# EAGLE design untitled (EAGLE 5.08)
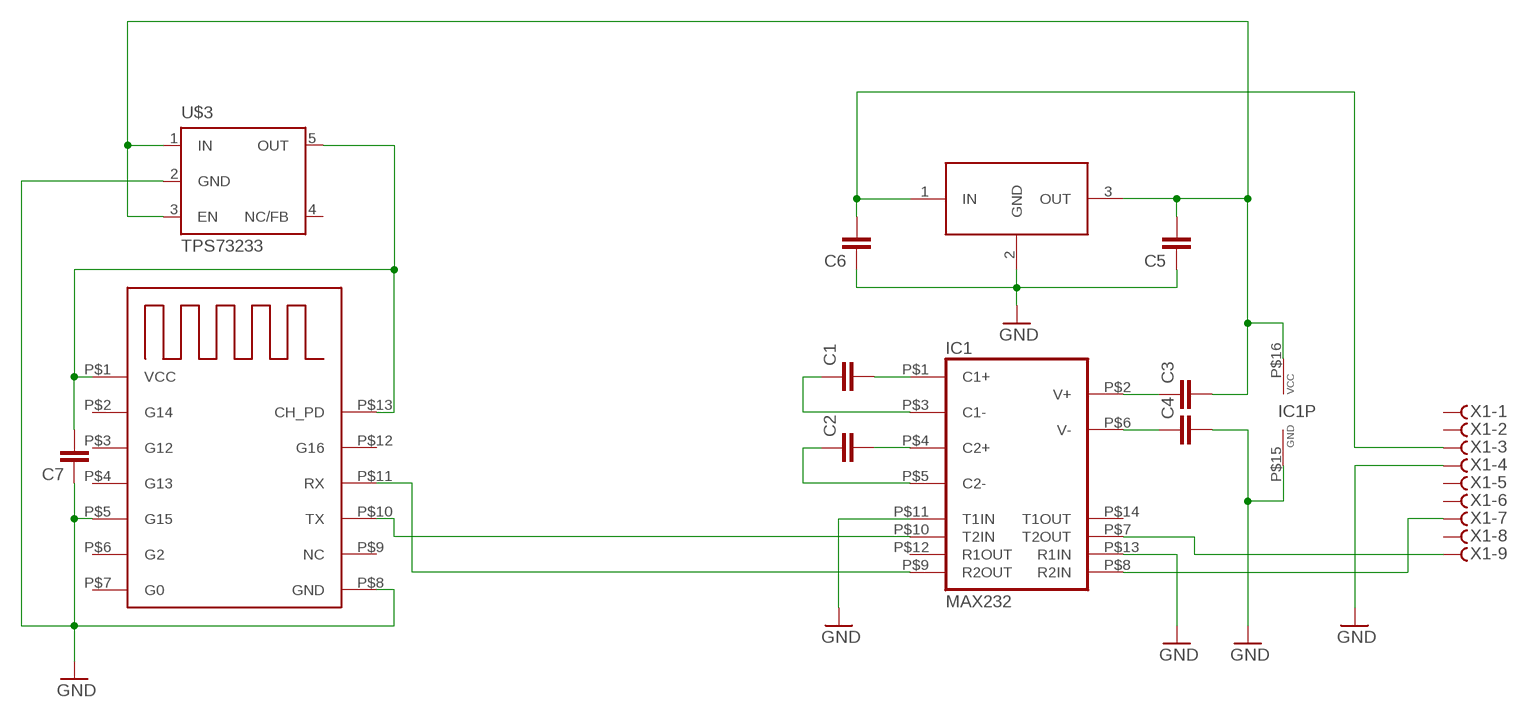
[diagram p0: schematic, sheet 1]

## Parts
C1  C-EUC1206K  [C1206K]
C2  C-EUC1206K  [C1206K]
C3  C-EUC1206K  [C1206K]
C4  C-EUC1206K  [C1206K]
C5  C-EUC1206K  [C1206K]
C6  C-EUC1206K  [C1206K]
C7  C-EUC1206K  [C1206K]
IC1  MAX232  [DIL16]
U$1  ESP03  [ESP03]
U$2  LM78M05BG  [DPACK]
U$3  TPS73233  [SOT23-DBV]
X1  F09HS  [F09H]

## Nets
GND: C4.2 C5.1 C6.1 C7.1 IC1.P$11(T1IN) IC1.P$13(R1IN) IC1.P$15(GND) U$1.P$5(G15) U$1.P$8(GND) U$2.2(GND) U$3.2(GND) X1.4
N$1: C2.2 IC1.P$4(C2+)
N$2: C2.1 IC1.P$5(C2-)
N$3: C1.2 IC1.P$1(C1+)
N$4: C1.1 IC1.P$3(C1-)
N$5: C3.1 IC1.P$2(V+)
N$6: C4.1 IC1.P$6(V-)
N$7: IC1.P$10(T2IN) U$1.P$10(TX)
N$8: IC1.P$9(R2OUT) U$1.P$11(RX)
N$9: IC1.P$7(T2OUT) X1.9
N$10: IC1.P$8(R2IN) X1.7
N$11: C6.2 U$2.1(IN) X1.3
N$13: C7.2 U$1.P$1(VCC) U$1.P$13(CH_PD) U$3.5(OUT)
N$15: C3.2 C5.2 IC1.P$16(VCC) U$2.3(OUT) U$3.1(IN) U$3.3(EN)
Unconnected: IC1.P$12(R1OUT) IC1.P$14(T1OUT) U$1.P$2(G14) U$1.P$3(G12) U$1.P$4(G13) U$1.P$6(G2) U$1.P$7(G0) U$1.P$9(NC) U$1.P$12(G16) U$3.4(NC/FB) X1.1 X1.2 X1.5 X1.6 X1.8

## Library data of the parts
C1-C7 = rcl:C-EU: CAPACITOR, European symbol
IC1 = connectors:MAX232: RS232 TRANSEIVER
U$1 = connectors:ESP03
U$2 = stabil:LM78M05BG
U$3 = stabil:TPS73233
X1 = con-subd:F09?S: SUB-D

## Board
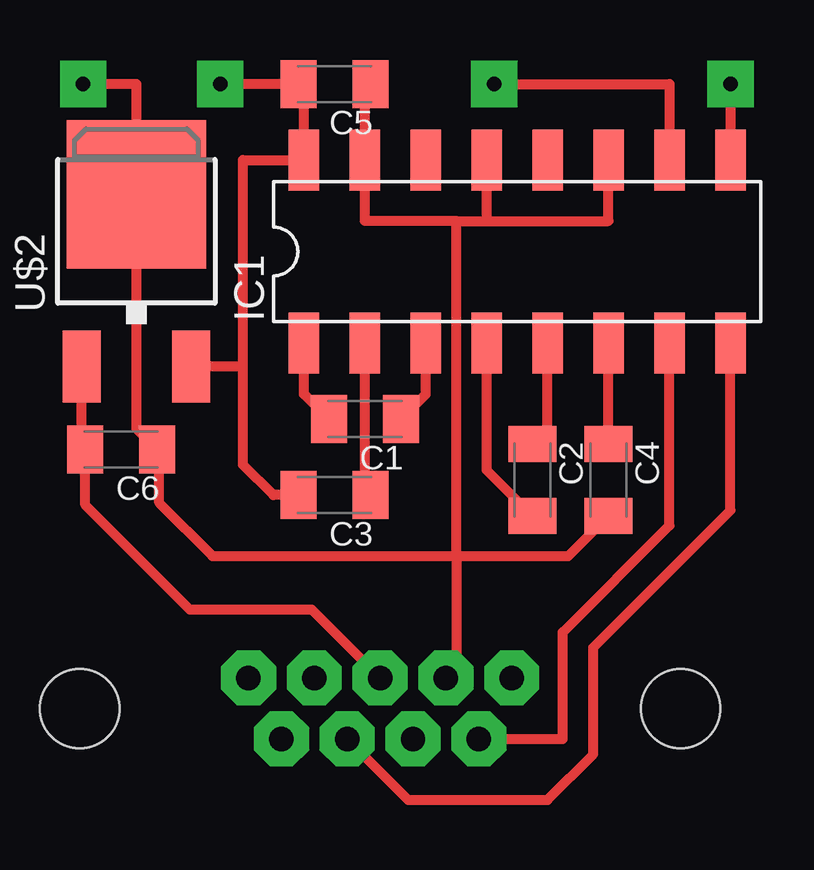
[diagram p1: board, top side]
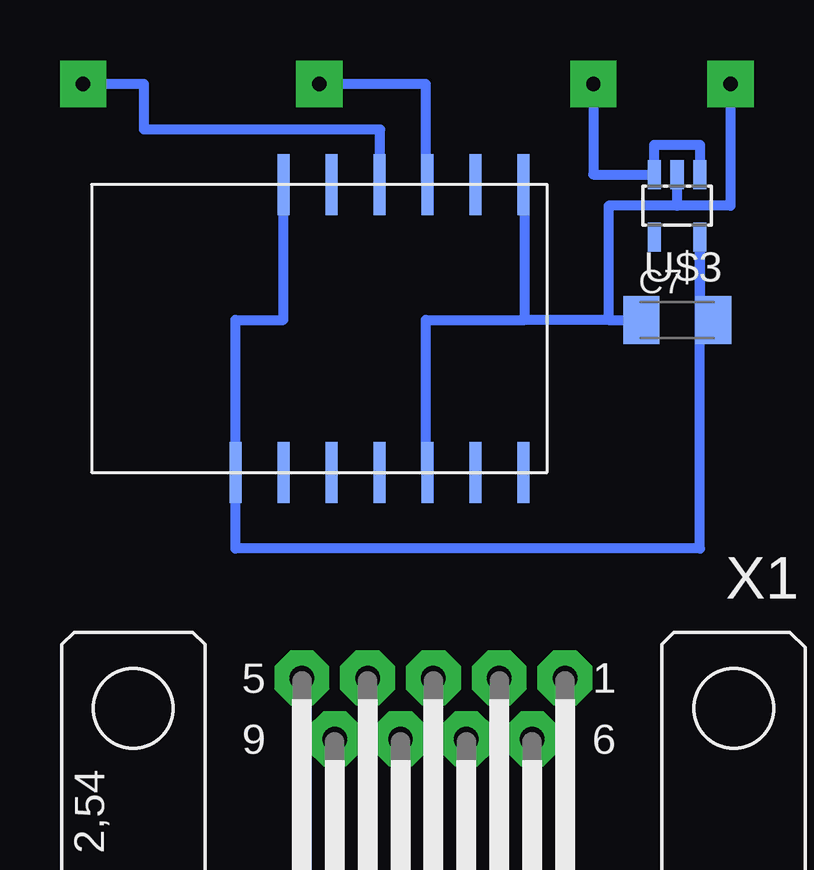
[diagram p2: board, bottom side, seen from below]

No outline drawn. Coordinates in mm, seen from the top.
Copper layers (1*16): Top 0.018mm / dielectric 1mm / Bottom 0.018mm
Design rules "default *": minimum track width 0.3mm, minimum drill 0.3mm, track to track 0.3mm, track to pad 0.3mm, pad to pad 0.3mm, via to via 0.3mm, smd to smd 0.16mm, copper to edge 0.25mm, drill to drill 0.25mm, minimum pad ring 25mil, minimum via ring 12mil, stop-mask expansion 4mil, vias tented up to drill 0mil, thermal gap 10mil

### Footprints (pad centres in the part's own frame; a part is rotated, then mirrored left to right if it is on the bottom)
C1206K = smd 1.5 x 2: 1 -1.5,0; 2 1.5,0
DIL16 = smd 1.27 x 2.54: P$1 -8.89,-3.81; P$2 -6.35,-3.81; P$3 -3.81,-3.81; P$4 -1.27,-3.81; P$5 1.27,-3.81; P$6 3.81,-3.81; P$7 6.35,-3.81; P$8 8.89,-3.81; P$9 8.89,3.81; P$10 6.35,3.81; P$11 3.81,3.81; P$12 1.27,3.81; P$13 -1.27,3.81; P$14 -3.81,3.81; P$15 -6.35,3.81; P$16 -8.89,3.81
ESP03 = smd 2.54 x 0.5: P$1 0,0; P$2 0,-2; P$3 0,-4; P$4 0,-6; P$5 0,-8; P$6 0,-10; P$7 0,-12; P$8 12,-12; P$9 12,-10; P$10 12,-8; P$11 12,-6; P$12 12,-4; P$13 12,-2
DPACK = smd 1.6 x 3: 1 -2.28,-4.8; 3 2.28,-4.8 | smd 5.8 x 6.2: 2 0,2.38
SOT23-DBV = smd 0.55 x 1.2: 1 -0.95,-1.3; 2 0,-1.3; 3 0.95,-1.3; 4 0.95,1.3; 5 -0.95,1.3
F09H = drill 1.016 octagon: 1 -5.486,-1.27; 2 -2.743,-1.27; 3 0,-1.27; 4 2.743,-1.27; 5 5.486,-1.27; 6 -4.115,1.27; 7 -1.372,1.27; 8 1.372,1.27; 9 4.115,1.27 | hole 3.302: -12.522,0; 12.522,0

### Placement (x,y rotation side)
C1  10.16,27.3 180 top
C2  17.14,24.77 270 top
C3  8.89,24.13 180 top
C4  20.32,24.77 270 top
C5  8.89,41.27 180 top
C6  0,26.04 180 top
C7  0.64,31.43 0 bottom
IC1  16.51,34.29 0 top
U$1  19.05,25.08 90 bottom
U$2  0.64,34.29 0 top
U$3  0.64,36.2 180 bottom
X1  10.79,15.24 180 bottom

### Tracks (layer width: path | path; a pad name or v marks a point on that pad's centre or on a via)
GND  (via drill 0.6 pad 1.93)
  Top 0.406: 20.32,23.5 C4.2 18.64,21.59 13.97,21.59 | 15.24,35.56 IC1.P$13 | 15.24,35.56 20.32,35.56 IC1.P$11 | 13.97,35.56 10.16,35.56 IC1.P$15 10.16,41.27 C5.1 | 13.97,35.56 15.24,35.56 | U$2.2 1.27,36.67 | U$2.2 0.64,26.9 C6.1 1.59,25.95 1.59,23.81 3.81,21.59 13.97,21.59 | X1.4 13.97,16.51 13.97,21.59 | 13.97,21.59 13.97,35.56 | v-1.59,41.27 0.64,41.27 U$2.2
  Bottom 0.406: 0.64,36.2 3.49,36.2 3.49,31.43 | 0.64,36.2 U$3.2 | 3.49,31.43 C7.1 | U$1.P$5 11.11,25.08 11.11,31.43 6.99,31.43 | U$1.P$8 6.99,37.08 6.99,31.43 | 0.64,36.2 -1.59,36.2 v-1.59,41.27 | 3.49,31.43 6.99,31.43
N$1
  Top 0.406: 15.01,30.48 IC1.P$4 15.24,25.17 C2.2
N$2
  Top 0.406: C2.1 17.78,26.27 IC1.P$5
N$3
  Top 0.406: IC1.P$1 7.62,28.34 C1.2
N$4
  Top 0.406: IC1.P$3 12.7,28.34 C1.1
N$5
  Top 0.406: IC1.P$2 10.16,23.73 C3.1
N$6
  Top 0.406: C4.1 IC1.P$6
N$7  (via drill 0.6 pad 1.93)
  Top 0.406: v15.56,41.27 22.86,41.27 IC1.P$10
  Bottom 0.406: U$1.P$10 11.11,37.08 11.11,41.27 v15.56,41.27
N$8  (via drill 0.6 pad 1.93)
  Top 0.406: v25.4,41.27 IC1.P$9
  Bottom 0.406: U$1.P$11 13.02,37.08 13.02,39.37 22.86,39.37 22.86,41.27 v25.4,41.27
N$9
  Top 0.406: X1.9 18.41,13.97 18.41,18.41 22.86,22.86 IC1.P$7
N$10
  Top 0.406: IC1.P$8 25.4,23.5 19.68,17.78 19.68,13.34 17.78,11.43 11.96,11.43 X1.7
N$11
  Top 0.406: U$2.1 -1.65,26.04 C6.2 -1.5,23.73 2.86,19.37 7.94,19.37 X1.3
N$13
  Bottom 0.406: C7.2 -0.32,31.43 U$3.5 -0.32,21.91 19.05,21.91 U$1.P$1 19.05,31.43 17.05,31.43 U$1.P$13
N$15  (via drill 0.6 pad 1.93)
  Top 0.406: 5.08,29.49 U$2.3 | 5.08,29.49 5.08,38.1 IC1.P$16 7.62,41.27 C5.2 v4.13,41.27 | 5.08,29.49 5.08,25.4 6.35,24.13 C3.2
  Bottom 0.406: U$3.1 -0.32,38.73 1.58,38.73 U$3.3 4.13,37.49 v4.13,41.27